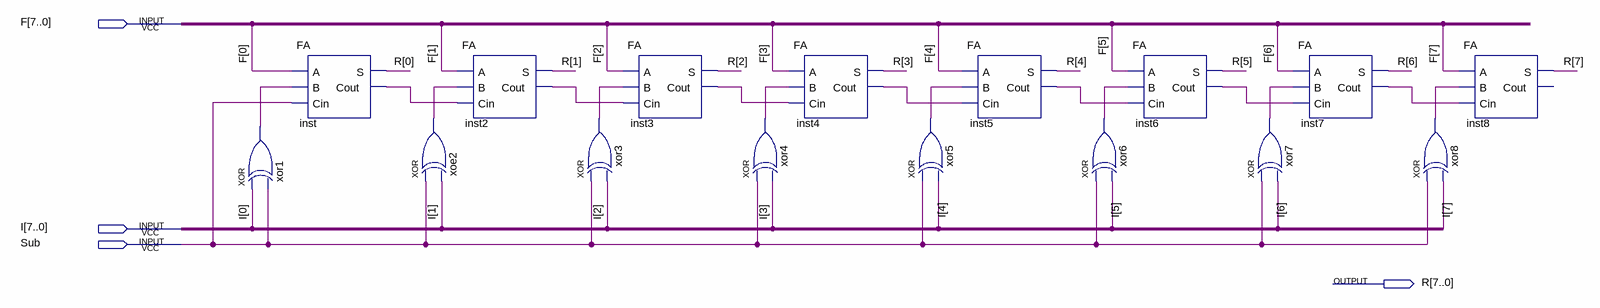
[diagram p0: schematic sheet]
// Quartus schematic Adder8bit.bdf as structural Verilog: 16 symbols, 4 pins
module Adder8bit (
  input  [7:0] F,
  input  [7:0] I,
  input  Sub,
  output [7:0] R
);

  wire inst2_cout, inst3_cout, inst4_cout, inst5_cout, inst6_cout, inst7_cout, inst_cout, xoe2_out, xor1_out,
       xor3_out, xor4_out, xor5_out, xor6_out, xor7_out, xor8_out;

  xor xor1 (xor1_out, I[0], Sub);
  FA inst (.A(F[0]), .B(xor1_out), .Cin(Sub), .S(R[0]), .Cout(inst_cout));
  xor xoe2 (xoe2_out, Sub, I[1]);
  FA inst2 (.A(F[1]), .B(xoe2_out), .Cin(inst_cout), .S(R[1]), .Cout(inst2_cout));
  FA inst3 (.A(F[2]), .B(xor3_out), .Cin(inst2_cout), .S(R[2]), .Cout(inst3_cout));
  xor xor3 (xor3_out, Sub, I[2]);
  xor xor4 (xor4_out, Sub, I[3]);
  FA inst4 (.A(F[3]), .B(xor4_out), .Cin(inst3_cout), .S(R[3]), .Cout(inst4_cout));
  xor xor5 (xor5_out, Sub, I[4]);
  FA inst5 (.A(F[4]), .B(xor5_out), .Cin(inst4_cout), .S(R[4]), .Cout(inst5_cout));
  FA inst6 (.A(F[5]), .B(xor6_out), .Cin(inst5_cout), .S(R[5]), .Cout(inst6_cout));
  xor xor6 (xor6_out, Sub, I[5]);
  xor xor7 (xor7_out, Sub, I[6]);
  FA inst7 (.A(F[6]), .B(xor7_out), .Cin(inst6_cout), .S(R[6]), .Cout(inst7_cout));
  xor xor8 (xor8_out, Sub, I[7]);
  FA inst8 (.A(F[7]), .B(xor8_out), .Cin(inst7_cout), .S(R[7]));  // open: Cout
endmodule
